# EAGLE design GDEnvSensorNode_1_3c (EAGLE 9.1.1)
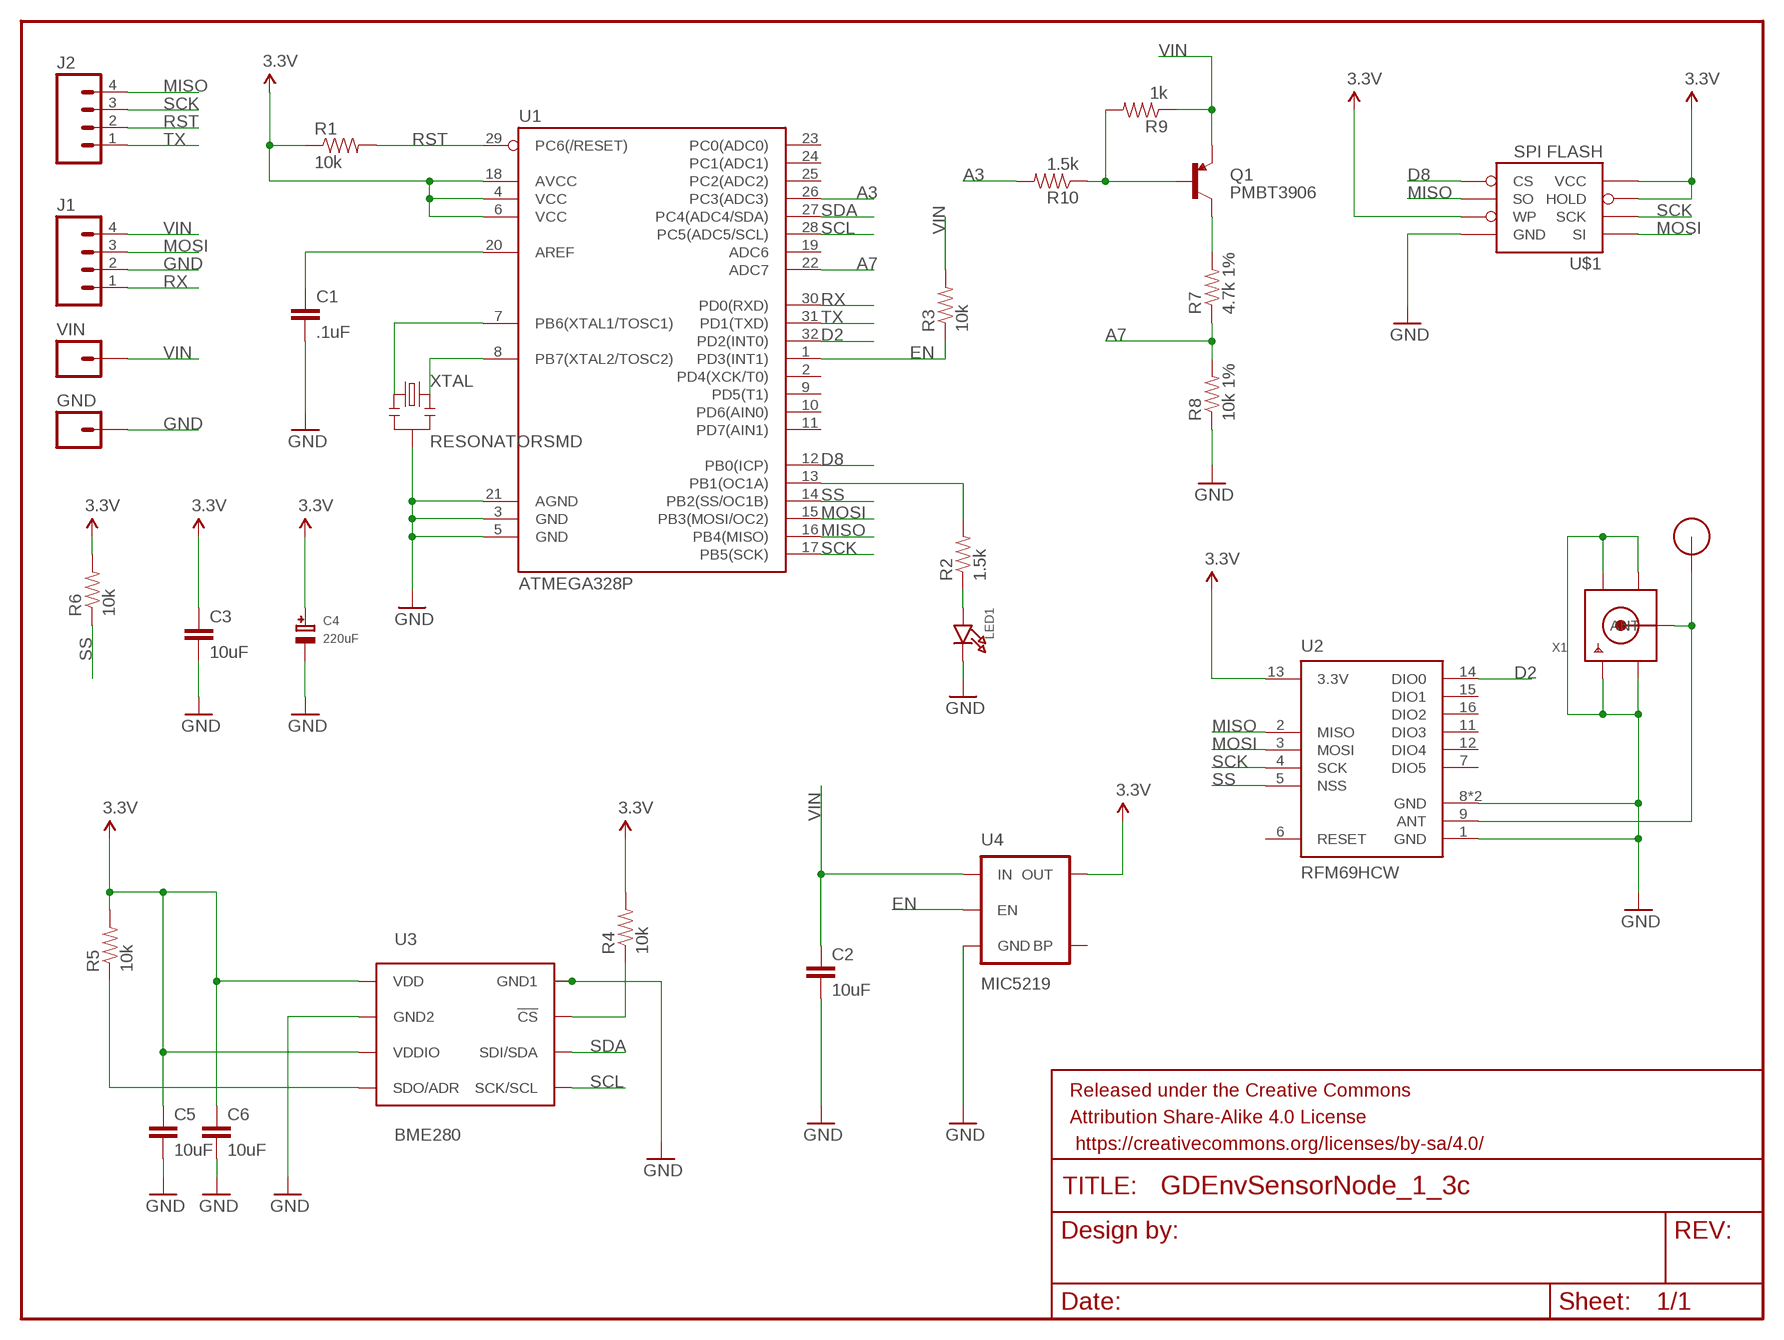
[diagram p0: schematic, sheet 1]

## Parts
C1  .1uF  CAP0805  [0805]
C2  10uF  CAP0805  [0805]
C3  10uF  CAP0805  [0805]
C4  220uF  CAP_TANTALUMB/3528_REFLOW  [EIA3528-21/B-R]
C5  10uF  CAP0805  [0805]
C6  10uF  CAP0805  [0805]
FRAME1  FRAME-LETTER  [CREATIVE_COMMONS]
GND  M01PTH_2MM  [1X01_2MM]
J1  M04PTH  [1X04]
J2  M04PTH  [1X04]
LED1  LED0805  [CHIPLED_0805]
Q1  PMBT3906  TRANSISTOR_PNPPMBT3906  [SOT23-3]
R1  10k  RESISTOR0805-RES  [0805]
R2  1.5k  RESISTOR0805-RES  [0805]
R3  10k  RESISTOR0805-RES  [0805]
R4  10k  RESISTOR0805-RES  [0805]
R5  10k  RESISTOR0805-RES  [0805]
R6  10k  RESISTOR0805-RES  [0805]
R7  4.7k 1%  RESISTOR0805-RES  [0805]
R8  10k 1%  RESISTOR0805-RES  [0805]
R9  1k  RESISTOR0805-RES  [0805]
R10  1.5k  RESISTOR0805-RES  [0805]
U1  ATMEGA328P  ATMEGA328P_TQFP  [TQFP32-08]
U2  RFM69HCW  [RFM69HCW-XXXS2]
U3  BME280  [BME280_LGA]
U4  MIC5219  V_REG_MIC52193.3V  [SOT23-5]
U$1  SPI FLASH  AT25F512BJEDEC_3.9MM  [SO08]
U$4  RFM12B_ANTENNA  [RFM12B-ANTENNA]
VIN  M01PTH_2MM  [1X01_2MM]
X1  SMACONNECTOR_EDGE_UFL  [SMA_EDGELAUNCH_UFL]
XTAL  RESONATORSMD  [RESONATOR-SMD]

## Nets
3.3V: C3.1 C4.+ R1.1 R4.2 R6.2 U1.4(VCC) U1.6(VCC) U1.18(AVCC) U2.13(3.3V) U4.5(OUT) U$1.3_WP(WP) U$1.7_HOLD(HOLD) U$1.8_VCC(VCC)
A3: R10.2 U1.26(PC3(ADC3))
A7: R7.1 R8.2 U1.22(ADC7)
ANT: U2.9(ANT) U$4.P$1 X1.P(ANT)
D2: U1.32(PD2(INT0)) U2.14(DIO0)
D8: U1.12(PB0(ICP)) U$1.1_CS(CS)
EN: R3.1 U1.1(PD3(INT1)) U4.3(EN)
GND: C1.2 C2.2 C3.2 C4.- C5.2 C6.2 GND.1 J1.2 LED1.C R8.1 U1.3(GND) U1.5(GND) U1.21(AGND) U2.1(GND) U2.8(GND) U2.10(GND) U3.P$1(GND1) U3.P$7(GND2) U4.2(GND) U$1.4_GND(GND) X1.GND@1(GND1) X1.GND@2(GND2) X1.GND@3(GND3) X1.GND@4(GND4) XTAL.2
MISO: J2.4 U1.16(PB4(MISO)) U2.2(MISO) U$1.2_SO(SO)
MOSI: J1.3 U1.15(PB3(MOSI/OC2)) U2.3(MOSI) U$1.5_SI(SI)
N$1: U1.8(PB7(XTAL2/TOSC2)) XTAL.3
N$2: U1.7(PB6(XTAL1/TOSC1)) XTAL.1
N$3: LED1.A R2.1
N$5: R4.1 U3.P$2(!CS)
N$8: R2.2 U1.13(PB1(OC1A))
N$11: Q1.1(B) R9.2 R10.1
N$12: Q1.3(C) R7.2
N$13: C1.1 U1.20(AREF)
N$15: C5.1 C6.1 R5.2 U3.P$6(VDDIO) U3.P$8(VDD)
N$17: R5.1 U3.P$5(SDO/ADR)
RST: J2.2 R1.2 U1.29(PC6(/RESET))
RX: J1.1 U1.30(PD0(RXD))
SCK: J2.3 U1.17(PB5(SCK)) U2.4(SCK) U$1.6_SCK(SCK)
SCL: U1.28(PC5(ADC5/SCL)) U3.P$4(SCK/SCL)
SDA: U1.27(PC4(ADC4/SDA)) U3.P$3(SDI/SDA)
SS: R6.1 U1.14(PB2(SS/OC1B)) U2.5(NSS)
TX: J2.1 U1.31(PD1(TXD))
VIN: C2.1 J1.4 Q1.2(E) R3.2 R9.1 U4.1(IN) VIN.1
Unconnected: U1.2(PD4(XCK/T0)) U1.9(PD5(T1)) U1.10(PD6(AIN0)) U1.11(PD7(AIN1)) U1.19(ADC6) U1.23(PC0(ADC0)) U1.24(PC1(ADC1)) U1.25(PC2(ADC2)) U2.6(RESET) U2.7(DIO5) U2.11(DIO3) U2.12(DIO4) U2.15(DIO1) U2.16(DIO2) U4.4(BP)

## Library data of the parts
C1-C3 C5 C6 = SparkFun-Capacitors:CAP: Capacitor Standard 0603 ceramic capacitor, and 0.1" leaded capacitor.
C4 = microbuilder:CAP_TANTALUM: Tantalum Capacitors Wave footprints have larger pads and are meant to be used for hand soldering. Reflow footprints are optimised for solder paste and a reflow oven. EIA3216-18/A-[R/W] - Size A / 3216-18 / 1206 footprint 4.7µF 25V 10% Tantalum Capacitor 10µF 16V 10% Tantalum Capacitor [Digikey: 495-2236-2-ND] EIA3528-21/B-[R/W] - Size B / 3528-21 47µF 10V 10% Tantalum Capactior [Digikey: 495-2216-1-ND] EIA6032-28/C-[R/W] - Size C / 6032-28 10µF 35V 20% Tantalum Capacitor [Digikey: 495-2285-1-ND] 100µF 16V 10% Tantalum Capactior [Digikey: 399-5214-1-ND]
FRAME1 = SparkFun-Aesthetics:FRAME-LETTER: Schematic Frame Standard 8.5x11 US Letter frame
GND VIN = SparkFun-Connectors:M01: Header 1 Standard 1-pin 0.1" header. Use with straight break away headers (SKU : PRT-00116), right angle break away headers (PRT-00553), swiss pins (PRT-00743), machine pins (PRT-00117), and female headers (PRT-00115). SMTSO-256-ET is a "flush mount" nut for a 4-40 screw. The older package used to be too tight, and did not allow it to sit properly thru the drill hit. The latest (0.165DIA) fits nice and snug.
J1 J2 = SparkFun-Connectors:M04: Header 4 Standard 4-pin 0.1" header. Use with straight break away headers (SKU : PRT-00116), right angle break away headers (PRT-00553), swiss pins (PRT-00743), machine pins (PRT-00117), and female headers (PRT-00115). Molex polarized connector foot print use with SKU : PRT-08231 with associated crimp pins and housings. 1MM SMD Version SKU: PRT-10208; PROD_ID: CONN-09696
LED1 = microbuilder:LED: LED 0603 - 0603 Surface Mount Package 2mA: Green LED - Low Power (3.9mcd, 2ma, 1.7Vf) - Digikey: 475-2709-2-ND Orange LED - Low Power (9.8mcd, 2ma, 1.8Vf) - Digikey: 475-1194-2-ND Red LED - Low Power (5mcd, 2ma, 1.8Vf) - Digikey: 475-1195-2-ND Yellow LED - Low Power (7mcd, 2ma, 1.8Vf) - Digikey: 475-1196-2-ND 5mA: Blue LED - Low Power (17mcd, 5ma, 2.9Vf) - Digikey: LNJ937W8CRACT-ND 0805 - 0805 Surface Mount Package 2mA: Red LED (8.8mcd, 2mA, 1.8Vf, Clear) - Low Power [Digikey: 475-2510-1-ND] Green LED (5mcd, 2mA, 1.8Vf, Clear) - Low Power [Digikey: 475-2730-1-ND] Yellow LED (11.3mcd, 2mA, 1.8Vf, Clear) - Low Power [Digikey: 475-2555-1-ND] 20mA: Red LED (104mcd, 20mA, Diffused) - LS R976 [Digikey: 475-1278-6-ND] Red LED (12mcd, 20mA, 2.0Vf, Clear) - APT2012EC [Digikey: 754-1128-1-ND] Green LED (15mcd, 20mA, 2.2Vf, Clear) - APT2012GC [Digikey: 754-1131-1-ND] Orange LED (160mcd, 20mA, 2.1Vf, Clear) - APT2012SECK [Digikey: 754-1130-1-ND] 1206 - 1206 Surface Mount Package Green LED (26mcd, 20mA, Diffused) - LG N971 [Digikey: 475-1407-6-ND] Red LED (15mcd, 20mA, Diffused) - LH N974 [Digikey: 475-1416-6-ND]
Q1 = SparkFun-DiscreteSemi:TRANSISTOR_PNP: Generic PNP BJT Double check pinouts against datasheets- not all devices are the same! MMBT3906 - 40V 200mA SOT-23 (TRANS-08052) MMBT4403 - 40V 600mA SOT-23 (TRANS-09245); PROD_ID: TRANS-08052
R1-R10 = SparkFun-Passives:RESISTOR: Resistor Basic schematic elements and footprints for 0603, 1206, and PTH resistors.
U1 = SparkFun-DigitalIC:ATMEGA328P_TQFP; PROD_ID: IC-09069; VALUE: ATMEGA328P_TQFP
U2 = SparkFun-RF:RFM69H; PROD_ID: IC-11997, IC-12053
U3 = BME280ComponentLibrary:BME280; PROD_ID: IC-13090
U4 = SparkFun-PowerIC:V_REG_MIC5219: V_REG MIC5219 Standard 3.3V and 5V 500mA LDO voltage regulator in SOT-23 layout. Micrel part MIC5219. BP (by-pass) pin is used to lower output noise with 470pF cap, may be left open.; PROD_ID: VREG-09872; VALUE: MIC5219 3.3V
U$1 = LowPowerLab:AT25F512B: 4-Mbit SPI flash memory
U$4 = LowPowerLab:RFM12B_ANTENNA
X1 = adafruit:SMACONNECTOR: SMA Connector 90° DIP SMA Connector, 50 Ohm (4UConnector: 07259)
XTAL = GDTech:RESONATOR: Resonator Small SMD resonator. This is the itty bitty 10/20MHz resonators with built in caps. CSTCE10M0G55 and CSTCE20M0V53. Footprint has been reviewed closely but hasn't been tested yet.

## Board
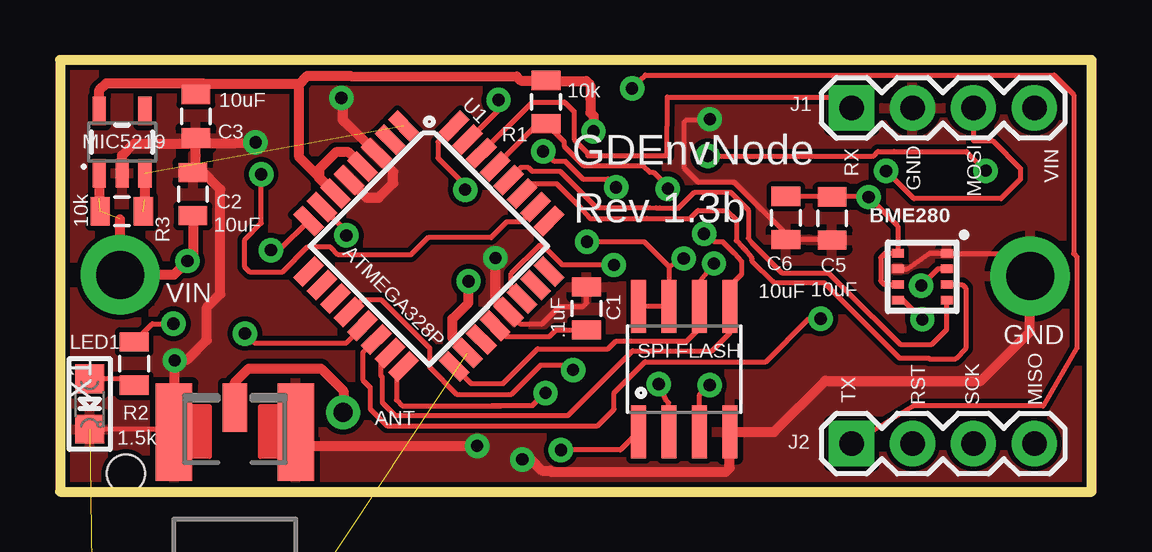
[diagram p1: board, top side]
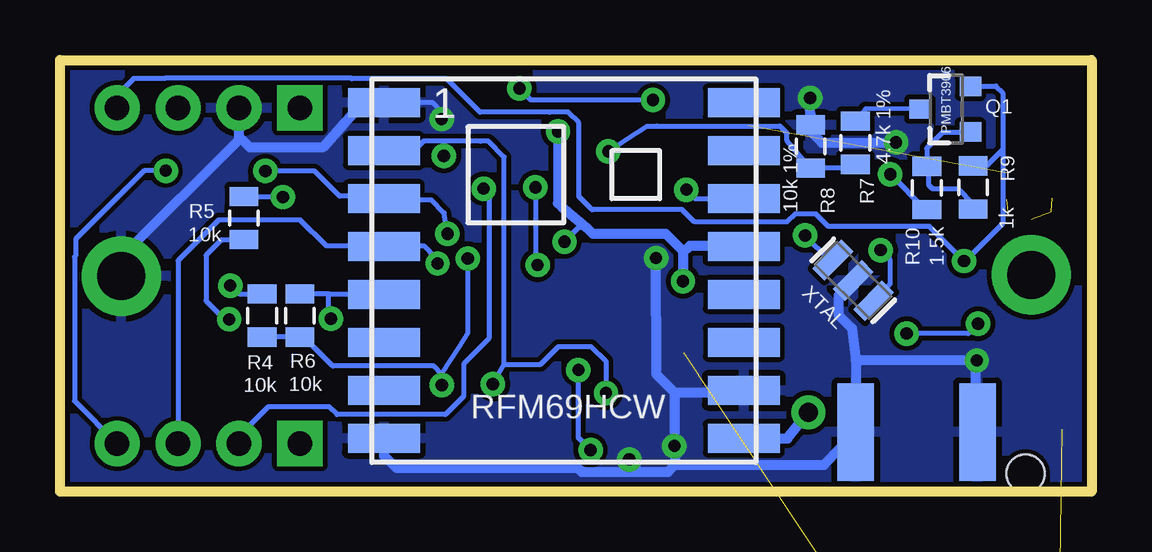
[diagram p2: board, bottom side, seen from below]

Size 43 x 18 mm. Coordinates in mm from the lower left corner, seen from the top.
Outline: 0,0 43,0 43,18 0,18 0,0
Copper layers (1*16): Top 0.035mm / dielectric 1.5mm / Bottom 0.035mm
Design rules "SparkFun": minimum track width 8mil, minimum drill 20mil, track to track 8mil, track to pad 8mil, pad to pad 8mil, via to via 8mil, smd to smd 8mil, copper to edge 8mil, drill to drill 8mil, minimum pad ring 12mil, minimum via ring 10mil, stop-mask expansion 4mil, vias tented up to drill 20mil, thermal gap 10mil
Holes 1.6 mm at 2.75,0.75

### Footprints (pad centres in the part's own frame; a part is rotated, then mirrored left to right if it is on the bottom)
0805 = smd 0.8 x 1.2: 1 -0.9,0; 2 0.9,0
EIA3528-21/B-R = smd 1.95 x 2.5: + 1.525,0; - -1.525,0
1X01_2MM = drill 2 pad 3.302: 1 0,0
1X04 = drill 1.016 pad 1.88 square: 1 0,0 | drill 1.016 pad 1.88: 2 2.54,0; 3 5.08,0; 4 7.62,0
CHIPLED_0805 = smd 1.2 x 1.2: A 0,-1.05; C 0,1.05
SOT23-3 = smd 0.8 x 0.9: 1 -0.95,-1; 2 0.95,-1; 3 0,1.1
TQFP32-08 = smd 1.27 x 0.559: 1 -4.293,2.8; 2 -4.293,2; 3 -4.293,1.2; 4 -4.293,0.4; 5 -4.293,-0.4; 6 -4.293,-1.2; 7 -4.293,-2; 8 -4.293,-2.8; 17 4.293,-2.8; 18 4.293,-2; 19 4.293,-1.2; 20 4.293,-0.4; 21 4.293,0.4; 22 4.293,1.2; 23 4.293,2; 24 4.293,2.8 | smd 0.559 x 1.27: 9 -2.8,-4.293; 10 -2,-4.293; 11 -1.2,-4.293; 12 -0.4,-4.293; 13 0.4,-4.293; 14 1.2,-4.293; 15 2,-4.293; 16 2.8,-4.293; 25 2.8,4.293; 26 2,4.293; 27 1.2,4.293; 28 0.4,4.293; 29 -0.4,4.293; 30 -1.2,4.293; 31 -2,4.293; 32 -2.8,4.293
RFM69HCW-XXXS2 = smd 3 x 1.2: 1 -7.5,7; 2 -7.5,5; 3 -7.5,3; 4 -7.5,1; 5 -7.5,-1; 6 -7.5,-3; 7 -7.5,-5; 8 -7.5,-7; 9 7.5,-7; 10 7.5,-5; 11 7.5,-3; 12 7.5,-1; 13 7.5,1; 14 7.5,3; 15 7.5,5; 16 7.5,7
BME280_LGA = smd 0.5 x 0.35: P$1 1.025,0.975; P$2 1.025,0.325; P$3 1.025,-0.325; P$4 1.025,-0.975; P$5 -1.025,-0.975; P$6 -1.025,-0.325; P$7 -1.025,0.325; P$8 -1.025,0.975
SOT23-5 = smd 0.55 x 1.2: 1 -0.95,-1.3; 2 0,-1.3; 3 0.95,-1.3; 4 0.95,1.3; 5 -0.95,1.3
SO08 = smd 0.61 x 2.21: 1_CS -1.905,-2.616; 2_SO -0.635,-2.616; 3_WP 0.635,-2.616; 4_GND 1.905,-2.616; 5_SI 1.905,2.616; 6_SCK 0.635,2.616; 7_HOLD -0.635,2.616; 8_VCC -1.905,2.616
RFM12B-ANTENNA = drill 0.8 pad 1.422: P$1 0,0
SMA_EDGELAUNCH_UFL = smd 4.064 x 1.524: GND@1 2.032,-2.54; GND@2 2.032,2.54 | smd 4.064 x 1.524 bottom: GND@3 2.032,2.54; GND@4 2.032,-2.54 | smd 2.032 x 1.016: P 3.048,0
RESONATOR-SMD = smd 0.7 x 1.7: 1 -1.2,0; 2 0,0; 3 1.2,0

### Placement (x,y rotation side)
C1  21.95,7.63 90 top
C2  5.54,12.4 90 top
C3  5.67,15.65 270 top
C4  3,-13 0 top  (outside the outline)
C5  32.19,11.39 270 top
C6  30.26,11.42 270 top
FRAME1  35.59,-9.89 0 top  (outside the outline)
GND  40.44,8.98 0 top
J1  33,16 0 top
J2  33,2 0 top
LED1  1.24,3.65 180 top
Q1  6.05,15.95 90 bottom
R1  20.26,16.25 270 top
R2  3.09,5.34 90 top
R3  2.58,11.69 180 top
R4  34.58,7.34 270 bottom
R5  35.34,11.4 90 bottom
R6  33,7.34 270 bottom
R7  9.84,14.55 90 bottom
R8  11.71,14.39 270 bottom
R9  4.94,12.68 270 bottom
R10  6.87,12.66 270 bottom
U1  15.38,10.23 315 top
U2  22,9.21 0 bottom
U3  35.95,8.96 0 top
U4  2.59,14.57 0 top
U$1  26.02,5.11 0 top
U$4  11.8,3.3 0 top
VIN  2.51,9.04 0 top
X1  7.29,0.45 90 top
XTAL  9.94,8.81 315 bottom

### Tracks (layer width: path | path; a pad name or v marks a point on that pad's centre or on a via)
3.3V  (via drill 0.51 pad 1.02)  (1 unrouted)
  Top 0.203: U$1.3_WP 26.66,4.03 v27.08,4.44 | 25.39,9.38 v26,9.72 | 25.39,9.38 U$1.7_HOLD U$1.8_VCC | v21.97,10.42 24.35,10.42 25.39,9.38
  Top 0.406: U4.5 1.64,16.74 1.92,17.02 5.19,17.02 | 5.19,17.02 C3.1 | 9.97,17 6,17 5.98,17.02 5.19,17.02 | U1.4 12.03,14.15 11.51,14.15 10.8,13.44 10.8,13.08 11.46,12.42 U1.6 9.97,13.94 9.97,17 | 9.97,17 10.3,17.33 12.11,17.33 19.04,17.31 19.2,17.14 R1.1 20.29,17.12 21.93,17.12 22.11,16.94 22.11,16.38 22.11,15.79 22.24,15.66 v22.24,15.02 22.24,15.11 | U1.18 16.36,6.42 16.36,7.2 17.03,7.87 v17.03,8.77
  Bottom 0.203: R4.2 R6.2 32.81,6.41 31.63,5.23 27.41,5.23 27.09,4.91 | v27.08,4.44 27.09,4.91 | 27.09,4.91 26.34,6.05 26,6.61 v26,9.72 | 21.05,11.01 21.38,11.01 v21.97,10.42
  Bottom 0.406: v22.24,15.02 22.25,12.03 22.09,11.89 21.05,11.01 20.8,10.76 17.76,10.76 17.03,10.03 17.03,9.96 | U2.13 14.53,10.24 16.75,10.24 17.03,9.96 | 17.03,9.96 v17.03,8.77 17.03,8.75
A3  (via drill 0.51 pad 1.02)
  Top 0.203: v8.39,13.23 8.39,11.19 7.7,10.5 7.7,9.37 7.93,9.14 9.26,9.14 10.31,10.19 11.28,10.19 11.6,9.87 14.62,9.87 15.34,10.59 17.97,10.59 18.62,11.24 19,11.24 19.21,11.24 U1.26
  Bottom 0.203: v8.39,13.23 6.92,11.76 R10.2
A7  (via drill 0.51 pad 1.02)
  Top 0.203: U1.22 18.81,8.5 18.81,9.09 19.99,10.27 20.13,10.13 20.27,10.13 20.95,9.45 v23.09,9.45 22.76,9.45 | v20.14,14.19 20.2,14.19 20.62,13.77 21.07,13.77 21.8,13.04 22.83,13.04 v23.18,12.69
  Bottom 0.203: R7.1 9.81,13.49 R8.2 12.7,14.63 12.7,14.94 12.99,15.24 18.13,15.24 18.14,15.23 18.54,15.23 v20.14,14.19 | v23.18,12.69 23.18,9.54 v23.09,9.45
ANT
  Top 0.406: X1.P 7.29,4.55 7.87,5.13 10.88,5.13 11.82,4.19 11.81,3.52 U$4.P$1
  Bottom 0.406: U2.9 12.67,2.21 U$4.P$1
D2  (via drill 0.51 pad 1.02)
  Top 0.203: U1.32 15.76,14.58 15.76,13.91 16.89,12.78 v16.89,12.59
  Bottom 0.203: v16.89,12.59 16.52,12.21 U2.14
D8  (via drill 0.51 pad 1.02)
  Top 0.203: U1.12 12.58,8.01 13.38,8.01 15.41,5.98 15.41,5.19 16.56,4.04 17,4.04 18.8,4.04 20.03,5.27 21.19,5.27 v21.39,5.07 | U$1.1_CS 23.36,1.73 v20.88,1.73
  Bottom 0.203: v20.88,1.73 21.39,2.24 v21.39,5.07
EN  (2 unrouted)
  Top 0.406: U4.3 3.54,12.18
GND  (via drill 0.51 pad 1.02)  (1 unrouted)
  Top 0.203: GND.1 39.48,9.94 U3.P$1 36.25,9.94 35.33,9.29 U3.P$7 | C5.2 32.16,10.52 C6.2 30.26,10.75 29.26,11.75 29.25,11.75 28.12,12.89 26.62,12.89 26.04,13.47 26.04,15.42 26.13,15.51 27.07,15.51 v27.09,15.53 | LED1.C 4.58,2.6 X1.GND@2 4.75,5.5 | U1.21 19.19,6.99 20.1,6.99 20.82,7.71 21.79,7.71 21.95,7.87 C1.2
  Top 0.406: U4.2 2.59,14.02 3.08,14.51 5.43,14.51 C3.2 | 5.67,13.43 C3.2 | 5.67,13.43 C2.2 | C6.2 30.2,10.46 | C3.2 5.88,14.53 7.27,14.53 v8.15,14.56 | X1.GND@1 10.36,1.9 v17.39,1.9 | 4.75,5.5 4.75,4.01 | v4.78,5.47 4.75,5.5 | 4.75,5.5 5.3,5.5 6.12,6.32 6.12,7.67 6.68,8.23 6.68,12.6 5.85,13.43 5.67,13.43 | U1.5 12.78,12.26 13.29,12.26 13.89,12.86 13.89,13.34 13.19,14.04 U1.3 12.11,15.2 11.8,15.48 11.79,16.58 v11.73,16.42 | v18.15,9.74 18.14,9.31 18.14,8.02 18.68,7.48 U1.21 | GND.1 40.43,6.66 38.39,4.62 31.9,4.62 29.77,2.49 U$1.4_GND 27.91,2.47 27.91,0.97 27.76,0.82 20.5,0.82 20.45,0.87 20.1,0.87 19.63,1.34 v19.27,1.34
  Bottom 0.203: 8.02,14.79 8.03,14.78 v8.15,14.56 | v27.09,15.53 27.09,15.85 27.45,16.21 U2.1 | v4.78,5.47 4.78,2.46 X1.GND@2
  Bottom 0.406: 35.54,14.68 J1.2 | 35.54,14.68 40.36,9.86 40.36,9.06 GND.1 | U2.1 30.51,16.02 31.15,15.35 32.04,14.35 35.08,14.35 35.41,14.68 35.54,14.68 | U2.10 14.61,4.11 17.36,4.11 | 9.83,5.47 X1.GND@1 11.15,1.11 17.36,1.11 | 17.36,1.11 17.33,1.14 | X1.GND@2 4.82,2.5 4.82,5.16 5.13,5.47 | 5.13,5.47 9.83,5.47 | v4.78,5.47 4.91,5.34 5.13,5.47 | 9.83,5.47 9.98,6.81 10.54,7.36 10.54,8.17 10.32,8.41 XTAL.2 | 17.36,2 17.36,4.11 | 17.36,2 17.36,1.11 | 17.36,2 17.39,1.97 v17.39,1.9 | 11.7,15.72 R8.1 | R8.1 11.7,15.01 11.25,14.55 8.21,14.55 8.03,14.78 | R8.1 v11.73,16.42 | 17.36,4.11 18.13,4.88 v18.15,9.74 | U2.8 29.5,1.5 29,1 21.44,1 21.26,0.82 19,0.82 | 19,0.82 17.65,0.82 17.36,1.11 | 19,0.82 19,1.07 v19.27,1.34
  pour Top: 0,18 43,18 43,0 0,0
  pour Bottom: 0,18 43,18 43,0 0,0
MISO  (via drill 0.51 pad 1.02)
  Top 0.203: U$1.2_SO 25.37,2.5 25.37,3.71 25.29,3.79 v24.96,4.48 | U1.16 14.03,4.93 14.03,3.82 14.27,3.58 18,3.58 | 18,3.58 18.4,3.58 | 18,3.58 18.01,3.59 19.7,3.59 20.22,4.11 v20.24,4.11 | v27,14 33.92,14 34.1,14.18 34.78,14.18 37.79,14.18 v38.59,13.38
  Bottom 0.203: v24.96,4.48 24.48,5.31 | 24.48,5.31 24.48,13.95 25.14,14.61 25.47,14.61 25.48,14.62 27,14.62 | 27,14.62 27.84,14.62 28.25,14.21 U2.2 | 24.48,5.31 22.96,5.31 22.22,6.05 20.86,6.05 20.25,5.44 v20.25,4.12 v20.24,4.11 | 27,14.62 v27,14 | v38.59,13.38 39.5,13.38 42.34,10.54 42.34,9.85 42.4,9.79 42.4,3.78 J2.4
MOSI  (via drill 0.51 pad 1.02)
  Top 0.203: U1.15 13.37,5.4 13.37,4.84 13.43,4.78 13.43,3.71 13.96,3.18 18,3.18 | 18,3.18 18.44,3.18 | 18,3.18 18.01,3.17 21.17,3.17 23.87,5.87 24.66,5.87 27.18,5.87 27.89,6.58 27.93,6.58 U$1.5_SI 27.93,8.57 28.42,9.07 28.42,9.6 28.14,9.92 28.12,9.92 27.63,10.41 27.28,10.41 v26.85,10.75 | J1.3 38.08,14.63 38.88,14.63 40.04,13.47 40.04,13.03 39.22,12.21 35.6,12.21 v34.44,13.37
  Bottom 0.203: v34.44,13.37 32.39,13.37 31.34,12.32 29.61,12.32 U2.3 29.45,12.16 27.52,12.16 26.98,11.62 v26.85,10.75
N$1  (via drill 0.51 pad 1.02)
  Top 0.203: U1.8 9.14,10.07 v8.79,10.07
  Bottom 0.203: v8.79,10.07 8.41,9.69 8.41,8.64 XTAL.3
N$2  (via drill 0.51 pad 1.02)
  Top 0.203: U1.7 11.94,10.84 v11.94,10.68
  Bottom 0.203: v11.94,10.68 10.91,9.65 XTAL.1
N$3
  Top 0.203: R2.1 2.83,4.7 LED1.A
N$5  (via drill 0.51 pad 1.02)
  Top 0.203: U3.P$2 36.59,9.29 v35.9,8.59
  Bottom 0.203: v35.9,8.59 35.86,8.59 35.52,8.25 R4.1
N$8  (via drill 0.51 pad 1.02)
  Top 0.203: R2.2 3.85,7 v4.73,7 | v7.71,6.59 8.1,6.2 11.94,6.2 12.62,6.88 U1.13
  Bottom 0.203: v4.73,7 5.14,6.59 v7.71,6.59
N$11
  Bottom 0.203: Q1.1 5.08,14.97 6.22,14.97 6.87,14.32 R10.1 6.8,13.49 6.8,12.8 6.63,12.63 5.57,12.63 4.94,12 R9.2
N$12
  Bottom 0.203: Q1.3 9.41,15.96 R7.2
N$13
  Top 0.203: U1.20 18.58,6.46 20.4,6.46 20.68,6.74 C1.1
N$15  (via drill 0.51 pad 1.02)
  Top 0.203: C6.1 32.16,12.32 C5.1 33.7,12.29 | 33.7,12.29 v33.71,12.28 | 33.7,12.29 34.92,11.07 U3.P$8 34.38,9.94 34.21,9.76 34.21,8.79 34.36,8.64 U3.P$6
  Bottom 0.203: v33.71,12.28 35.31,12.28 R5.2
N$17  (via drill 0.51 pad 1.02)
  Top 0.203: v35.95,7.18 35.15,7.99 U3.P$5
  Bottom 0.203: R5.1 36.28,10.49 36.91,9.86 36.91,7.95 36.14,7.18 v35.95,7.18
RST  (via drill 0.51 pad 1.02)
  Top 0.203: v25.34,12.63 25.34,12.71 24.73,13.32 24.58,13.32 24.3,13.6 21.83,13.6 21.02,14.41 21.02,14.58 R1.2 19.92,15.35 U1.29
  Bottom 0.203: v25.34,12.63 25.12,12.41 25.12,6.39 25.95,5.56 26.17,5.32 26.17,3.97 26.93,3.21 31.45,3.21 31.78,3.54 34.32,3.54 35.54,2.32 J2.2
RX
  Top 0.203: J1.1 32.64,16 32.19,16.45 25.32,16.45 25.3,14.01 22,14.01 22,14.11 21.43,14.68 21.43,15.85 21.03,16.25 19.69,16.25 U1.30
SCK  (via drill 0.51 pad 1.02)
  Top 0.203: U1.17 17.14,4.51 18.47,4.51 19.91,5.95 22.85,5.95 23.18,6.28 26.14,6.28 26.66,6.79 26.66,6.8 26.66,7.32 U$1.6_SCK 26.66,8.74 v27.26,9.51
  Bottom 0.203: J2.3 38.08,9.63 36.38,11.33 32.98,11.33 31.89,10.24 29.52,10.24 U2.4 29.48,10.23 27.81,10.23 27.35,9.77 v27.26,9.51
SCL
  Top 0.203: U1.28 19.24,13.53 19.51,13.53 19.68,13.36 20.85,13.36 21.42,12.79 21.42,12.78 22.36,11.84 24.58,11.84 24.85,11.83 24.99,11.83 25,11.82 25.79,11.82 26.45,12.48 27.95,12.48 28.69,11.74 28.69,10.56 28.85,10.37 30.1,9.12 32.03,9.12 33.84,7.31 33.86,7.31 35.03,6.14 36.34,6.14 36.96,6.76 36.96,7.97 U3.P$4
SDA
  Top 0.203: U3.P$3 37.61,8.63 37.76,8.48 37.76,5.96 37.34,5.54 36.23,5.54 36.2,5.57 34.99,5.57 31.85,8.71 29.76,8.71 29.73,8.74 | U1.27 19.68,12.84 20.7,12.84 21.64,11.9 | 21.64,11.9 21.64,11.88 | 21.64,11.9 22.09,11.39 24.45,11.39 24.79,11.38 26.26,11.38 26.6,11.72 27.81,11.72 28.19,11.34 28.19,10.46 28.44,10.21 28.55,10.09 28.83,9.77 28.83,9.75 28.84,9.74 28.83,9.64 29.73,8.74 | 29.73,8.74 29.74,8.74
SS  (via drill 0.51 pad 1.02)
  Top 0.203: U1.14 12.62,5.78 12.62,4.66 12.93,4.35 12.93,3.44 13.63,2.74 22.41,2.74 23.1,3.43 23.1,4.12 24.39,5.41 29.42,5.41 31.22,7.21 v31.71,7.21
  Bottom 0.203: 31.8,8.24 R6.1 | 31.8,8.24 29.52,8.24 U2.5 | v31.71,7.21 31.8,7.3 31.8,8.24
TX  (via drill 0.51 pad 1.02)
  Top 0.203: U1.31 17.05,14.69 18.25,15.89 18.25,16.3 v18.28,16.33 | v23.85,16.81 v23.86,16.81 24.2,17.15 24.2,17.17 24.4,17.37 41.44,17.37 42.26,16.55 42.26,9.93 42.4,9.79 42.4,5.99 40.98,3.57 35.57,3.57 J2.1
  Bottom 0.203: v18.28,16.33 23.37,16.33 v23.85,16.81
VIN  (via drill 0.51 pad 1.02)  (2 unrouted)
  Top 0.406: 2.51,11.36 VIN.1 4.74,9.04 v5.32,9.62 5.54,9.85 C2.1 | U4.1 1.64,12.23
  Bottom 0.203: Q1.2 3.98,16.91 3.7,16.63 3.7,14.27 | 3.7,14.27 4.39,13.58 R9.1 | 3.7,14.27 3.7,11.18 5.26,9.62 v5.32,9.62 6.75,11.05 10.97,11.05 11.5,11.58 12.35,11.58 12.69,11.24 16.55,11.24 17.08,11.77 19.81,11.77 20.82,11.76 21.37,12.31 21.37,15.38 21.82,15.83 22.58,15.83 22.59,15.82 25.5,15.82 26.89,17.21 30.83,17.21 30.86,17.25 38.6,17.25 38.62,17.22 39.93,17.22 40.62,16.53 J1.4

### Text on the board
tPlace: GDEnvNode | RX | GND | VIN | MOSI | Rev 1.3b | TX | RST | SCK | MISO